# Altium project RF_Power_AMP.PrjPcb
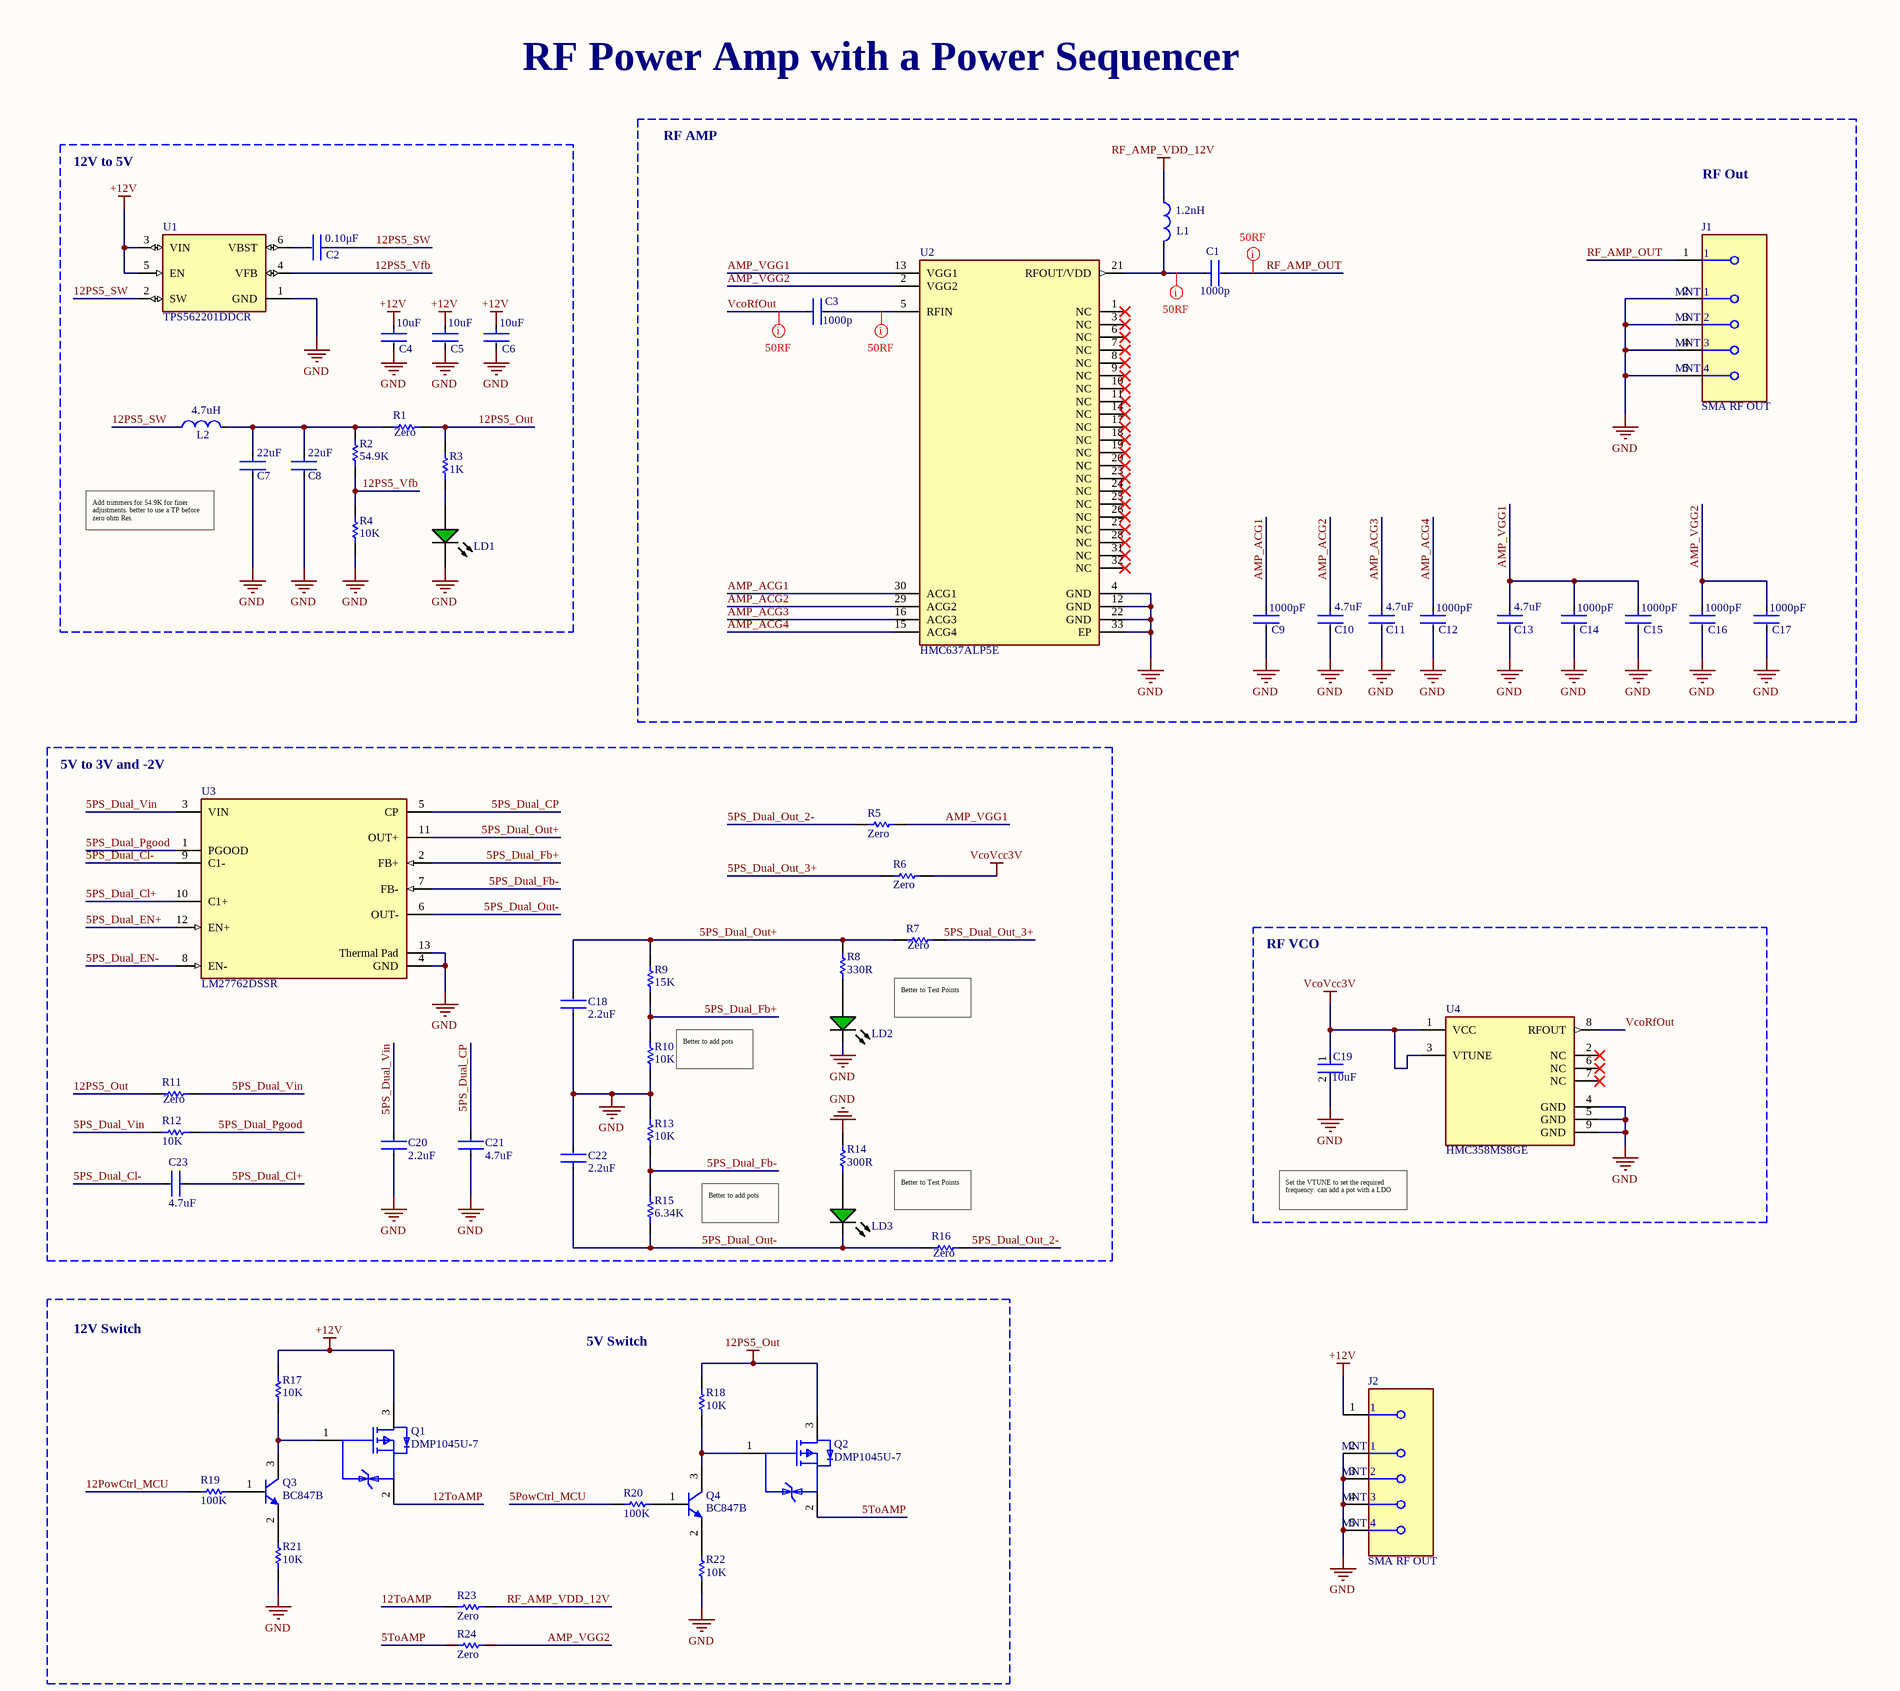
[diagram p0: Sheet1.SchDoc, top]
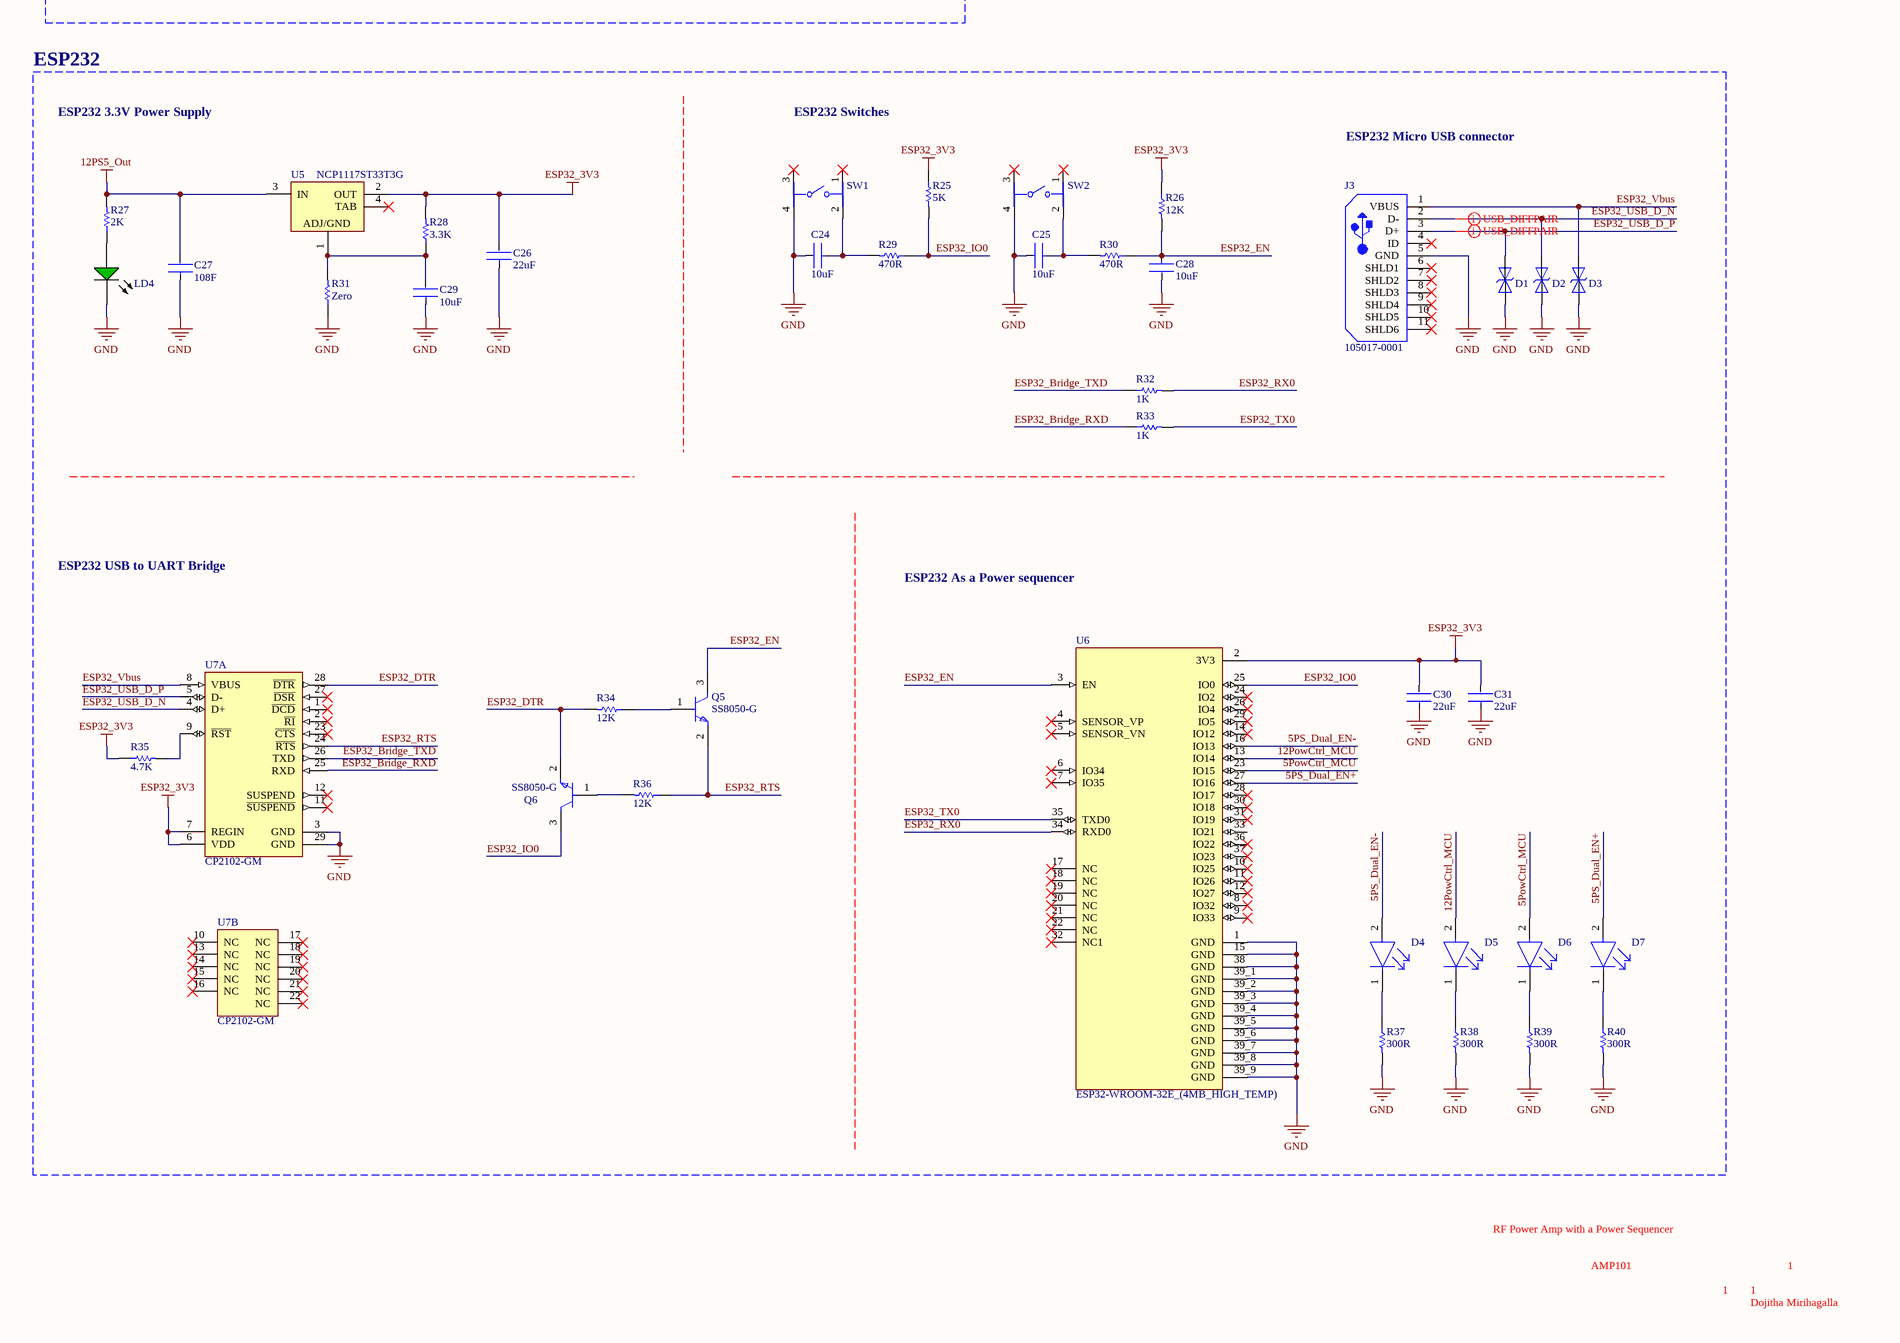
[diagram p1: Sheet1.SchDoc, bottom]
1 sheet, 102 parts. Net scope: global (net labels, ports and power ports of the same name join across sheets).
Board file: PCB1.PcbDoc

## Sheet Sheet1.SchDoc
size 381 x 609 mm; SheetNumber: 1; SheetTotal: 1

### Parts
C1  Capacitance: 1000p  [FP-GCM155-0_05-IPC_A]  (hidden comment: GCM1555C1H102FA16D)
C2  Capacitance: 0.10μF  [FP-GRM15-MFG]  (hidden comment: GRM155R71C104KA88D)
C3  Capacitance: 1000p  [FP-GCM155-0_05-IPC_A]  (hidden comment: GCM1555C1H102FA16D)
C4  Capacitance: 10uF  [FP-GRM188-0_1-e0_2_0_55-IPC_A]  (hidden comment: GRM188R60J106ME47D)
C5  Capacitance: 10uF  [FP-GRM188-0_1-e0_2_0_55-IPC_A]  (hidden comment: GRM188R60J106ME47D)
C6  Capacitance: 10uF  [FP-GRM188-0_1-e0_2_0_55-IPC_A]  (hidden comment: GRM188R60J106ME47D)
C7  Capacitance: 22uF  [FP-GRM21B-0_15-MFG]  (hidden comment: GRM21BR60J226ME39L)
C8  Capacitance: 22uF  [FP-GRM21B-0_15-MFG]  (hidden comment: GRM21BR60J226ME39L)
C9  Capacitance: 1000pF  [FP-0603-L_1_6_0_15-W_0_81-IPC_A]  (hidden comment: 06035C102KAT2A)
C10  Capacitance: 4.7uF  [FP-CL282-IPC_C]  (hidden comment: CL05A475MP5NRNC)
C11  Capacitance: 4.7uF  [FP-CL282-IPC_C]  (hidden comment: CL05A475MP5NRNC)
C12  Capacitance: 1000pF  [FP-0603-L_1_6_0_15-W_0_81-IPC_A]  (hidden comment: 06035C102KAT2A)
C13  Capacitance: 4.7uF  [FP-CL282-IPC_C]  (hidden comment: CL05A475MP5NRNC)
C14  Capacitance: 1000pF  [FP-0603-L_1_6_0_15-W_0_81-IPC_A]  (hidden comment: 06035C102KAT2A)
C15  Capacitance: 1000pF  [FP-0603-L_1_6_0_15-W_0_81-IPC_A]  (hidden comment: 06035C102KAT2A)
C16  Capacitance: 1000pF  [FP-0603-L_1_6_0_15-W_0_81-IPC_A]  (hidden comment: 06035C102KAT2A)
C17  Capacitance: 1000pF  [FP-0603-L_1_6_0_15-W_0_81-IPC_A]  (hidden comment: 06035C102KAT2A)
C18  Capacitance: 2.2uF  [FP-CL282-IPC_C]  (hidden comment: CL05A475MP5NRNC)
C19  Capacitance: 10uF  [FP-GRJ155-0_2-MFG]  (hidden comment: GRJ155R60J106ME11D)
C20  Capacitance: 2.2uF  [FP-CL282-IPC_C]  (hidden comment: CL05A475MP5NRNC)
C21  Capacitance: 4.7uF  [FP-CL282-IPC_C]  (hidden comment: CL05A475MP5NRNC)
C22  Capacitance: 2.2uF  [FP-CL282-IPC_C]  (hidden comment: CL05A475MP5NRNC)
C23  Capacitance: 4.7uF  [FP-CL282-IPC_C]  (hidden comment: CL05A475MP5NRNC)
C24  Capacitance: 10uF  [FP-CL282-IPC_C]  (hidden comment: CL05A475MP5NRNC)
C25  Capacitance: 10uF  [FP-CL282-IPC_C]  (hidden comment: CL05A475MP5NRNC)
C26  Capacitance: 22uF  [FP-CL282-IPC_C]  (hidden comment: CL05A475MP5NRNC)
C27  Capacitance: 108F  [FP-CL282-IPC_C]  (hidden comment: CL05A475MP5NRNC)
C28  Capacitance: 10uF  [FP-CL282-IPC_C]  (hidden comment: CL05A475MP5NRNC)
C29  Capacitance: 10uF  [FP-CL282-IPC_C]  (hidden comment: CL05A475MP5NRNC)
C30  Capacitance: 22uF  [FP-CL282-IPC_C]  (hidden comment: CL05A475MP5NRNC)
C31  Capacitance: 22uF  [FP-CL282-IPC_C]  (hidden comment: CL05A475MP5NRNC)
D1  SMF16A  [SODFL3718X102N]  (value not drawn)
D2  SMF16A  [SODFL3718X102N]  (value not drawn)
D3  SMF16A  [SODFL3718X102N]  (value not drawn)
D4  LTST-C191TBKT  [FP-LTST-C191TBKT-MFG]  (value not drawn)
D5  LTST-C191TBKT  [FP-LTST-C191TBKT-MFG]  (value not drawn)
D6  LTST-C191TBKT  [FP-LTST-C191TBKT-MFG]  (value not drawn)
D7  LTST-C191TBKT  [FP-LTST-C191TBKT-MFG]  (value not drawn)
J1  SMA RF OUT  [FP-SMA-J-P-H-ST-EM1-MFG]
J2  SMA RF OUT  [FP-SMA-J-P-H-ST-EM1-MFG]
J3  105017-0001  [USB-MICRO-B_V]
L1  Inductance: 1.2nH  [FP-LQP03HQ_02-MFG]  (hidden comment: LQP03HQ1N2B02D)
L2  Inductance: 4.7uH  [FP-NR6028-MFG]  (hidden comment: NR6028T4R7M)
LD1  HSMG-C170  [AVAG-HSMX-C170_V]  (value not drawn)
LD2  HSMG-C170  [AVAG-HSMX-C170_V]  (value not drawn)
LD3  HSMG-C170  [AVAG-HSMX-C170_V]  (value not drawn)
LD4  HSMG-C170  [AVAG-HSMX-C170_V]  (value not drawn)
Q1  DMP1045U-7  [FP-SOT23-MFG]
Q2  DMP1045U-7  [FP-SOT23-MFG]
Q3  BC847B  [INF-SOT23_M]
Q4  BC847B  [INF-SOT23_M]
Q5  SS8050-G  [FP-SS8050-G-MFG]
Q6  SS8050-G  [FP-SS8050-G-MFG]
R1  Resistance: Zero  [RESC1609X50X30LL10T20]  (hidden comment: CRCW060354K9FKEA)
R2  Resistance: 54.9K  [RESC1609X50X30LL10T20]  (hidden comment: CRCW060354K9FKEA)
R3  Resistance: 1K  [RESC1609X50X30LL10T20]  (hidden comment: CRCW060354K9FKEA)
R4  Resistance: 10K  [RESC1609X50X30LL10T20]  (hidden comment: CRCW060354K9FKEA)
R5  Resistance: Zero  [RESC1609X50X30LL10T20]  (hidden comment: CRCW060354K9FKEA)
R6  Resistance: Zero  [RESC1609X50X30LL10T20]  (hidden comment: CRCW060354K9FKEA)
R7  Resistance: Zero  [RESC1609X50X30LL10T20]  (hidden comment: CRCW060354K9FKEA)
R8  Resistance: 330R  [RESC1609X50X30LL10T20]  (hidden comment: CRCW060354K9FKEA)
R9  Resistance: 15K  [RESC1609X50X30LL10T20]  (hidden comment: CRCW060354K9FKEA)
R10  Resistance: 10K  [RESC1609X50X30LL10T20]  (hidden comment: CRCW060354K9FKEA)
R11  Resistance: Zero  [RESC1609X50X30LL10T20]  (hidden comment: CRCW060354K9FKEA)
R12  Resistance: 10K  [RESC1609X50X30LL10T20]  (hidden comment: CRCW060354K9FKEA)
R13  Resistance: 10K  [RESC1609X50X30LL10T20]  (hidden comment: CRCW060354K9FKEA)
R14  Resistance: 300R  [RESC1609X50X30LL10T20]  (hidden comment: CRCW060354K9FKEA)
R15  Resistance: 6.34K  [RESC1609X50X30LL10T20]  (hidden comment: CRCW060354K9FKEA)
R16  Resistance: Zero  [RESC1609X50X30LL10T20]  (hidden comment: CRCW060354K9FKEA)
R17  Resistance: 10K  [RESC1609X50X30LL10T20]  (hidden comment: CRCW060354K9FKEA)
R18  Resistance: 10K  [RESC1609X50X30LL10T20]  (hidden comment: CRCW060354K9FKEA)
R19  Resistance: 100K  [RESC1609X50X30LL10T20]  (hidden comment: CRCW060354K9FKEA)
R20  Resistance: 100K  [RESC1609X50X30LL10T20]  (hidden comment: CRCW060354K9FKEA)
R21  Resistance: 10K  [RESC1609X50X30LL10T20]  (hidden comment: CRCW060354K9FKEA)
R22  Resistance: 10K  [RESC1609X50X30LL10T20]  (hidden comment: CRCW060354K9FKEA)
R23  Resistance: Zero  [RESC1609X50X30LL10T20]  (hidden comment: CRCW060354K9FKEA)
R24  Resistance: Zero  [RESC1609X50X30LL10T20]  (hidden comment: CRCW060354K9FKEA)
R25  Resistance: 5K  [RESC1609X50X30LL10T20]  (hidden comment: CRCW060354K9FKEA)
R26  Resistance: 12K  [RESC1609X50X30LL10T20]  (hidden comment: CRCW060354K9FKEA)
R27  Resistance: 2K  [RESC1609X50X30LL10T20]  (hidden comment: CRCW060354K9FKEA)
R28  Resistance: 3.3K  [RESC1609X50X30LL10T20]  (hidden comment: CRCW060354K9FKEA)
R29  Resistance: 470R  [RESC1609X50X30LL10T20]  (hidden comment: CRCW060354K9FKEA)
R30  Resistance: 470R  [RESC1609X50X30LL10T20]  (hidden comment: CRCW060354K9FKEA)
R31  Resistance: Zero  [RESC1609X50X30LL10T20]  (hidden comment: CRCW060354K9FKEA)
R32  Resistance: 1K  [RESC1609X50X30LL10T20]  (hidden comment: CRCW060354K9FKEA)
R33  Resistance: 1K  [RESC1609X50X30LL10T20]  (hidden comment: CRCW060354K9FKEA)
R34  Resistance: 12K  [RESC1609X50X30LL10T20]  (hidden comment: CRCW060354K9FKEA)
R35  Resistance: 4.7K  [RESC1609X50X30LL10T20]  (hidden comment: CRCW060354K9FKEA)
R36  Resistance: 12K  [RESC1609X50X30LL10T20]  (hidden comment: CRCW060354K9FKEA)
R37  Resistance: 300R  [RESC1609X50X30LL10T20]  (hidden comment: CRCW060354K9FKEA)
R38  Resistance: 300R  [RESC1609X50X30LL10T20]  (hidden comment: CRCW060354K9FKEA)
R39  Resistance: 300R  [RESC1609X50X30LL10T20]  (hidden comment: CRCW060354K9FKEA)
R40  Resistance: 300R  [RESC1609X50X30LL10T20]  (hidden comment: CRCW060354K9FKEA)
SW1  PTS645SM43SMTR92LFS  [FP-PTS645SM43SMTR92LFS-MFG]  (value not drawn)
SW2  PTS645SM43SMTR92LFS  [FP-PTS645SM43SMTR92LFS-MFG]  (value not drawn)
U1  TPS562201DDCR  [FP-DDC0006A-IPC_C]
U2  HMC637ALP5E  [FP-HCP-32-1-IPC_A]
U3  LM27762DSSR  [FP-DSS0012B-MFG]
U4  HMC358MS8GE  [FP-MS8GE-MFG]
U5  NCP1117ST33T3G  [ONSC-SOT-223-4-318H-01_A_V]
U6  ESP32-WROOM-32E_(4MB_HIGH_TEMP)  [XCVR_ESP32-WROOM-32E_(4MB_HIGH_TEMP)]
U7  CP2102-GM  [SLAB-QFN-28-3125x3125TP_N]  (parts A,B of 2)

### Blocks framed on the sheet
12V to 5V: C2 C4-C8 L2 LD1 R1-R4 U1
5V to 3V and -2V: C18 C20-C23 LD2 LD3 R5-R16 U3
RF VCO: C19 U4
ESP232: C24-C31 D1-D7 J3 LD4 Q5 Q6 R25-R40 SW1 SW2 U5-U7

### Nets
12PS5_Out: C27.2 Q2.3(D) R1.1 R3.1 R11.2 R18.2 R27.2 U5.3(IN)
+12V: C4.1 C5.1 C6.1 J2.1 Q1.3(D) R17.2 U1.3(VIN) U1.5(EN)
ESP32_3V3: C26.2 C30.2 C31.2 R25.1 R26.1 R28.2 R35.1 U5.2(OUT) U6.2(3V3) U7.6(VDD) U7.7(REGIN)
GND: C4.2 C5.2 C6.2 C7.2 C8.2 C9.2 C10.2 C11.2 C12.2 C13.2 C14.2 C15.2 C16.2 C17.2 C18.1 C19.2 C20.1 C21.1 C22.2 C24.2 C25.2 C26.1 C27.1 C28.2 C29.1 C30.1 C31.1 D1.C D2.C D3.C J1.2(MNT_1) J1.3(MNT_2) J1.4(MNT_3) J1.5(MNT_4) J2.2(MNT_1) J2.3(MNT_2) J2.4(MNT_3) J2.5(MNT_4) J3.5(GND) LD1.2(K) LD2.2(K) LD4.2(K) R4.1 R10.1 R13.2 R14.1 R21.1 R22.1 R31.1 R37.2 R38.2 R39.2 R40.2 SW1.4 SW2.4 U1.1(GND) U2.4(GND) U2.12(GND) U2.22(GND) U2.33(EP) U3.4(GND) U3.13(Thermal_Pad) U4.4(GND) U4.5(GND) U4.9(GND) U6.1(GND) U6.15(GND) U6.38(GND) U6.39_1(GND) U6.39_2(GND) U6.39_3(GND) U6.39_4(GND) U6.39_5(GND) U6.39_6(GND) U6.39_7(GND) U6.39_8(GND) U6.39_9(GND) U7.3(GND) U7.29(GND)
RF_AMP_VDD_12V: L1.1 R23.2
VcoVcc3V: C19.1 R6.2 U4.1(VCC) U4.3(VTUNE)
5PowCtrl_MCU: D6.2(A) R20.1 U6.23(IO15)
5PS_Dual_Cl+: C23.1 U3.10(C1+)
5PS_Dual_Cl-: C23.2 U3.9(C1-)
5PS_Dual_CP: C21.2 U3.5(CP)
5PS_Dual_EN+: D7.2(A) U3.12(EN+) U6.27(IO16)
5PS_Dual_EN-: D4.2(A) U3.8(EN-) U6.16(IO13)
5PS_Dual_Fb+: R9.1 R10.2 U3.2(FB+)
5PS_Dual_Fb-: R13.1 R15.2 U3.7(FB-)
5PS_Dual_Out+: C18.2 R7.2 R8.1 R9.2 U3.11(OUT+)
5PS_Dual_Out-: C22.1 LD3.2(K) R15.1 R16.2 U3.6(OUT-)
5PS_Dual_Out_2-: R5.1 R16.1
5PS_Dual_Out_3+: R6.1 R7.1
5PS_Dual_Pgood: R12.2 U3.1(PGOOD)
5PS_Dual_Vin: C20.2 R11.1 R12.1 U3.3(VIN)
5ToAMP: Q2.2(S) R24.1
12PowCtrl_MCU: D5.2(A) R19.1 U6.13(IO14)
12PS5_SW: C2.2 L2.1 U1.2(SW)
12PS5_Vfb: R2.1 R4.2 U1.4(VFB)
12ToAMP: Q1.2(S) R23.1
AMP_ACG1: C9.1 U2.30(ACG1)
AMP_ACG2: C10.1 U2.29(ACG2)
AMP_ACG3: C11.1 U2.16(ACG3)
AMP_ACG4: C12.1 U2.15(ACG4)
AMP_VGG1: C13.1 C14.1 C15.1 R5.2 U2.13(VGG1)
AMP_VGG2: C16.1 C17.1 R24.2 U2.2(VGG2)
ESP32_Bridge_RXD: R33.1 U7.25(RXD)
ESP32_Bridge_TXD: R32.1 U7.26(TXD)
ESP32_DTR: Q6.2(E) R34.2 U7.28(~{DTR})
ESP32_EN: C28.1 Q5.3(C) R26.2 R30.1 U6.3(EN)
ESP32_IO0: Q6.3(C) R25.2 R29.1 U6.25(IO0)
ESP32_RTS: Q5.2(E) R36.1 U7.24(~{RTS})
ESP32_RX0: R32.2 U6.34(RXD0)
ESP32_TX0: R33.2 U6.35(TXD0)
ESP32_USB_D_N: D2.A J3.2(D-) U7.4(D+)
ESP32_USB_D_P: D1.A J3.3(D+) U7.5(D-)
ESP32_Vbus: D3.A J3.1(VBUS) U7.8(VBUS)
RF_AMP_OUT: C1.2 J1.1
VcoRfOut: C3.1 U4.8(RFOUT)
NetC1_1: C1.1 L1.2 U2.21(RFOUT/VDD)
NetC2_1: C2.1 U1.6(VBST)
NetC3_2: C3.2 U2.5(RFIN)
NetC7_1: C7.1 C8.1 L2.2 R1.2 R2.2
NetC24_1: C24.1 R29.2 SW1.2
NetC25_1: C25.1 R30.2 SW2.2
NetC29_2: C29.2 R28.1 R31.2 U5.1(ADJ/GND)
NetD4_1: D4.1(C) R37.1
NetD5_1: D5.1(C) R38.1
NetD6_1: D6.1(C) R39.1
NetD7_1: D7.1(C) R40.1
NetLD1_1: LD1.1(A) R3.2
NetLD2_1: LD2.1(A) R8.2
NetLD3_1: LD3.1(A) R14.2
NetLD4_1: LD4.1(A) R27.1
NetQ1_1: Q1.1(G) Q3.3(C) R17.1
NetQ2_1: Q2.1(G) Q4.3(C) R18.1
NetQ3_1: Q3.1(B) R19.2
NetQ3_2: Q3.2(E) R21.2
NetQ4_1: Q4.1(B) R20.2
NetQ4_2: Q4.2(E) R22.2
NetQ5_1: Q5.1(B) R34.1
NetQ6_1: Q6.1(B) R36.2
NetR35_2: R35.2 U7.9(~{RST})

Not connected (* = marked no-connect by the designer): J3 4(ID)* 6(SHLD1)* 7(SHLD2)* 8(SHLD3)* 9(SHLD4)* 10(SHLD5)* 11(SHLD6)*; SW1 1* 3*; SW2 1* 3*; U2 1(NC)* 3(NC)* 6(NC)* 7(NC)* 8(NC)* 9(NC)* 10(NC)* 11(NC)* 14(NC)* 17(NC)* 18(NC)* 19(NC)* 20(NC)* 23(NC)* 24(NC)* 25(NC)* 26(NC)* 27(NC)* 28(NC)* 31(NC)* 32(NC)*; U4 2(NC)* 6(NC)* 7(NC)*; U5 4(TAB)*; U6 4(SENSOR_VP)* 5(SENSOR_VN)* 6(IO34)* 7(IO35)* 8(IO32)* 9(IO33)* 10(IO25)* 11(IO26)* 12(IO27)* 14(IO12)* 17(NC)* 18(NC)* 19(NC)* 20(NC)* 21(NC)* 22(NC)* 24(IO2)* 26(IO4)* 28(IO17)* 29(IO5)* 30(IO18)* 31(IO19)* 32(NC1)* 33(IO21) 36(IO22)* 37(IO23)*; U7 1(~{DCD})* 2(~{RI})* 10(NC)* 11(~{SUSPEND})* 12(SUSPEND)* 13(NC)* 14(NC)* 15(NC)* 16(NC)* 17(NC)* 18(NC)* 19(NC)* 20(NC)* 21(NC)* 22(NC)* 23(~{CTS})* 27(~{DSR})*

### Layout directives
differential pair: ESP32_USB_D_N, ESP32_USB_D_P
net class 50RF: NetC1_1, NetC3_2, RF_AMP_OUT, VcoRfOut

### Notes on the sheet
- RF Power Amp with a Power Sequencer
- RF AMP
- RF Out
- Add trimmers for 54.9K for finer adjustments. better to use a TP before zero ohm Res.
- Better to Test Points
- (near R10) Better to add pots
- Better to add pots
- Set the VTUNE to set the required frequency. can add a pot with a LDO
- 12V Switch
- 5V Switch
- ESP232 3.3V Power Supply
- ESP232 Switches
- ESP232 Micro USB connector
- ESP232 USB to UART Bridge
- ESP232 As a Power sequencer
- AMP101
- 1
- Dojitha Mirihagalla

### Library data of the parts
C1 C3 = CMP-06035-056113-1: Ceramic Capacitor for Automotive 1nF ±1% 50VDC C0G 0402 Paper T/R; Voltage Rating: 50V; Case Code (Metric): 1005; Packaging: Tape and Reel; Max Operating Temperature: 125°C; Min Operating Temperature: -55°C; Case Code (Imperial): 0402; Mount: Surface Mount; Ratings: AEC-Q200; Tolerance: 1%; Case/Package: 0402
C2 = CMP-2100-03641-2: CAP CER 0.1UF 16V X7R 0402; Manufacturer: Murata; Standoff Height: 0mm; Tolerance: 10%; Voltage Rating: 16Vdc; Material: Ceramic; Value: 0.10μF; RoHS: TRUE; Manufacturer Part Number: GRM155R71C104KA88D; Temperature Characteristic: X7R; Octopart: https://octopart.com/grm155r71c104ka88d-murata-196880; Digikey Description: CAP CER 0.1UF 16V X7R 0402; Device Class L3: Ceramic Capacitors; Height: 0.55mm; ComponentLink2Description: Datasheet; Temperature Range Low: -55°C; Ipc Land Pattern Name: CAPC10050X219; ComponentLink2URL: https://search.murata.co.jp/Ceramy/image/img/A01X/G101/ENG/GRM155R71H471KA01-01A.pdf; Device Class L1: Passive Components; Lead Free: yes; Category: Cap; Package: GRM15; Temperature: -55°C to +125°C; Device Class L2: Capacitors; Temperature Range High: +125°C; Mouser Description: 0402 0.1 uF 16V ±10 % Tolerance X7R SMT Multilayer Ceramic Capacitor
C4-C6 = CMP-2006-02792-2: Chip Multilayer Ceramic Capacitors for General Purpose, 0603, 10uF, X5R, 15%, 20%, 6.3V; Packaging: Tape and Reel; Voltage Rating (DC): 6.3V; Width: 0.031inch; Termination: SMD/SMT; Dielectric: X5R; Package Quantity: 4000; Voltage Rating: 6.3V; Case/Package: 0603; Min Operating Temperature: -55°C; Voltage: 6.3V; Length: 1.6mm; Thickness: 0.035inch; Lead Free: Lead Free; Depth: 0.8mm; Case Code (Imperial): 0603; Max Operating Temperature: 85°C; Material: Ceramic; Height: 0.8mm; Tolerance: 20%; Mount: Surface Mount; REACH SVHC: No SVHC; Radiation Hardening: No; Case Code (Metric): 1608
C7 C8 = CMP-2007-03385-2: Chip Multilayer Ceramic Capacitors for General Purpose, 0805, 22uF, X5R, 15%, 20%, 6.3V; Material: Ceramic; Max Operating Temperature: 85°C; Voltage: 6.3V; Min Operating Temperature: -55°C; Case/Package: 0805; Thickness: 0.053inch; Dielectric: X5R; Packaging: Tape and Reel; Depth: 1.25mm; Termination: SMD/SMT; Voltage Rating (DC): 6.3V; Radiation Hardening: No; Tolerance: 20%; Mount: Surface Mount; Lead Free: Lead Free; Package Quantity: 1; REACH SVHC: No SVHC; Voltage Rating: 6.3V; Length: 2mm; Case Code (Imperial): 0805; Case Code (Metric): 2012; Width: 0.049inch; Height: 1.25mm
C9 C12 C14-C17 = CMP-2006-04378-2: General Purpose Ceramic Capacitor, 0603, 1nF, 10%, X7R, 15%, 50V; Case Code (Metric): 1608; Min Operating Temperature: -55°C; Weight: 7.1E-05oz; Series: -; RoHS Compliant: Yes; Radiation Hardening: No; Height: 0.9mm; Mount: Surface Mount; REACH SVHC: No SVHC; Lead Free: Lead Free; Depth: 0.81mm; Voltage: 50V; Number of Pins: 2; Voltage Rating: 50V; Max Operating Temperature: 125°C; Termination: SMD/SMT; Construction: Flat; Case Code (Imperial): 0603; Dielectric: X7R; Width: 0.032inch; Tolerance: 10%; Case/Package: 0603; Contact Plating: Tin; Packaging: Tape and Reel; Voltage Rating (DC): 50V; Dielectric Material: Ceramic; Package Quantity: 4000; Thickness: 0.035inch; Length: 1.6mm
C10 C11 C13 C18 C20-C31 = CMP-13271-000548-1: Cap Ceramic 4.7uF 10V X5R ±20% SMD 0402 +85°C Paper T/R; Max Operating Temperature: 85°C; Lead Free: Lead Free; Tolerance: 20%; Voltage Rating: 10V; Dielectric: X5R; Width: 0.02inch; Length: 0.039inch; Case/Package: 0402; Min Operating Temperature: -55°C; Packaging: Tape and Reel; Thickness: 0.022inch; Case Code (Imperial): 0402; Package Quantity: 10000; Case Code (Metric): 1005; Mount: Surface Mount
C19 = CMP-06035-062410-1: CAP CER 10UF 6.3V X5R 0402; Tolerance: 20%; Length: 0.039inch; Width: 0.02inch; Max Operating Temperature: 85°C; Features: Soft Termination; Case Code (Metric): 1005; Min Operating Temperature: -55°C; Thickness: 0.028inch; Mount: Surface Mount; Packaging: Cut Tape; Case/Package: 0402; Voltage Rating: 6.3V; Case Code (Imperial): 0402; RoHS Compliant: Yes
D1-D3 = SMF16A: 200W, 18.8V, 5%, Unidirectional, TVS; MF: Taiwan Semiconductor; SnapEDA_Link: https://www.snapeda.com/parts/SMF16A/taiwan/view-part/?ref=snap; Package: SOD-123W-2 Taiwan Semiconductor; Value: *; MP: SMF16A; Check_prices: https://www.snapeda.com/parts/SMF16A/taiwan/view-part/?ref=eda
D4-D7 = CMP-22017-000008-1: LED BLUE CLEAR CHIP SMD; Lens Color: Colorless; Dominant Wavelength: 475nm; Forward Current: 20mA; Wavelength: 468nm; Viewing Angle: 130°; Power Dissipation: 76mW; Luminous Intensity: 180mcd; Reverse Voltage: 5V; Number of Elements: 1; Lens Style: Diffused; Forward Voltage: 3.8V; Max Power Dissipation: 75mW; Case Code (Metric): 1608; Packaging: Tape and Reel; Case/Package: 0603; Depth: 1.6mm; Mount: Surface Mount; Lead Free: Lead Free; Min Operating Temperature: -20°C; Lens Transparency: Clear; Illumination Color: Blue; Height: 0.55mm; Test Current: 20mA; Case Code (Imperial): 0603; Max Operating Temperature: 80°C; Number of Pins: 2; Length: 0.8mm; Radiation Hardening: No; Package Quantity: 1; Number of LEDs: 1; Width: 0.8mm; Color: Blue
J1 J2 = CMP-02754-000006-1: CONN SMA JACK STR 50OHM EDGE MNT; Dielectric Material: PTFE; Center Contact Plating: Gold; Max Frequency: 6GHz; Body Material: Brass; Voltage Rating: 335V; Impedance: 50R; Package Quantity: 1; Case/Package: SMA; Max Operating Temperature: 125°C; Fastening Type: Threaded; Orientation: Straight; Depth: 13.33mm; RoHS Compliant: Yes; Length: 6.35mm; Insulation Material: Polytetrafluoroethylene; Termination: Solder; Min Operating Temperature: -65°C; Housing Color: Gold; Contact Plating: Gold; Contact Material: Copper; Connector Type: SMA; Mount: Edge; Series: SMA; Packaging: Tray; Body Plating: Gold; Radiation Hardening: No
J3 = CMP-2000-05827-1: Micro-USB B Receptacle, Right Angle, Bottom Mount, Surface Mount, with Solder Tabs, -30 to 85 degC, 5-Pin USB, RoHS, Tape and Reel; Manufacturer: Molex; Featured Product: Micro-USBConnectorsUSBConnectors; Other Names: WM1399DKR; Package Version: Rev. F, 12/2012; Number of Contacts: 5; Connector Type: USB-microB; Catalog Drawings: 1050170001; 3D Model: 105017-0001.stp; Mating Products: WM17145-ND-CABLEMICROUSBBTOSTDA1.0MWM17147-ND-CABLEMICROUSBBTOSTDA2.0MWM17146-ND-CABLEMICROUSBBTOSTDA1.5M; PCN Assembly/Origin: ResinSupplier21/Oct/2015; Voltage - Max: 30V; Online Catalog: Molex-MicroUSB; Manufacturer URL: http://www.molex.com/; Package Description: 5-Leads USB, Micro B, Body 7.5 x 5 mm, Pitch 0.65 mm; Datasheet URL: http://www.molex.com/elqNow/elqRedir.htm?ref=http://www.molex.com/webdocs/datasheets/pdf/en-us/1050170001_IO_CONNECTORS.pdf; Ingress Protection: -; Datasheet Version: 03/2016; Mounting Type: BoardCutout,SurfaceMount,RightAngle; Circuits: 5; Standard Package: 1; Package Reference: MICRO-B; Package URL: http://www.molex.com/pdm_docs/sd/1050170001_sd.pdf; Category: Connectors,Interconnects; Series: -; RoHS Information: 1050170001CertofCompliance; Features: Shielded,SolderRetention; Family: USB,DVI,HDMIConnectors; Specifications: -; Gender: Receptacle; Packaging: Digi-Reel®; Mounting Technology: SurfaceMount
L1 = CMP-06042-014208-1: Film type RF Inductor 1.2nH ±0.1nH 1100mA 0.04Ω 0201 (0603); Test Frequency: 500MHz; Self Resonant Frequency: 13GHz; Core Material: Non-Magnetic; DC Resistance (DCR): 40mR; Current Rating: 1.1A; Shielding: Unshielded; Mount: Surface Mount; Case/Package: 0201; Resistor Type: Thin Film; Min Operating Temperature: -55°C; Packaging: Tape and Reel; Case Code (Imperial): 0201; Case Code (Metric): 0603; Max Operating Temperature: 125°C
L2 = CMP-14484-000037-2: SMD Power Inductors 4.7uH ±20% 2.7A 40.3mΩ; Max DC Current: 3A; Shielding: Shielded; Core Material: Ferrite; Test Frequency: 100kHz; Self Resonant Frequency: 39MHz; DC Resistance (DCR): 40.3mR; Package Quantity: 2000; Mount: Surface Mount; Max Operating Temperature: 120°C; Min Operating Temperature: -25°C; Series: NR; Case/Package: 2424; Depth: 6.2mm; Inductance Tolerance: 20%; Halogen Free: Halogen Free; Tolerance: 20%; RoHS Compliant: Yes; Width: 0.236inch; Length: 0.236inch; Lead Free: Lead Free; Radiation Hardening: No; Packaging: Tape and Reel; Number of Pins: 2; Saturation Current: 2.7A; Current Rating: 3A; Height - Seated (Max): 0.11inch; RMS Current (Irms): 3A; Termination: SMD/SMT; Height: 2.8mm; Resistor Type: Wirewound
LD1-LD4 = CMP-2000-05062-1: Chip LED, Green, 2.2 V, -40 to 85 degC, 2-Pin SMD, Pb-Free, Tape and Reel; Manufacturer: Avago; No. of Pins: 2; Peak Wavelength: 570nm; SVHC: NoSVHC(16-Jun-2014); Dominant Wavelength: 572nm; Forward Current If: 20mA; Viewing Angle: 170deg; Lens Shape: Rectangular; PIV Max: 5V; External Width: 1.25mm; LED Type: Standard; External Depth: 0.8mm; Opto Mounting Orientation: Top; Luminous Intensity: 15mcd; Luminous Intensity Min: 4mcd; Forward Voltage VF Max: 2.6V; External Length / Height: 2mm; Bulb Size: 1.25mmx1.4mm; Light Area Height: 1mm; Voltage Vf Typ: 2.2V; Operating Temperature Max: 85degC; Datasheet Version: Oct-08; MSL: MSL2A-4weeks; Peak Forward Current: 20mA; Package Description: 2-Pin Surface Mount Device, Body 2 x 1.25 mm, Height 0.8 mm; Datasheet URL: https://datasheet.ciiva.com/29280/180495-da-01-en-chip-led-hsmg-c170-gelb-gruen-29280971.pdf; Storage Temperature Min: -40degC; LED Colour: Green; Wavelength Typ: 570nm; Mounting Type: SMD; Forward Current If Max: 20mA; Dominant Wavelength Typ: 572nm; LED Mounting: SMD; Operating Temperature Range: -30degCto+85degC; Operating Temperature Min: -30degC; Manufacturer URL: http://www.avagotech.com/; Packaging: CutTape; Luminous Intensity Typ: 15mcd; Package Reference: HSMX-C170; Storage Temperature Max: 85degC; Opto Case Style: SMD; Forward Voltage: 2.2V
Q1 Q2 = CMP-12801-000025-1: MOSFET P-CH 12V 4A SOT23; Manufacturer: Diodes Inc.; Drain To Source Voltage: -12V; Standoff Height: 0.013mm; Max Junction Temp: +150°C; Gate To Source Voltage: 8V; Number Of Channels: 1; Drain To Source Resistance: 26mΩ; Gate Charge At Vgs: 15.8nC @ -4.5V; Power Dissipation: 0.8W; Automotive Grade: NA; Pulse Drain Current: 40A; Turn Off Delay Time: 91.2ns; Depletion Mode: False; Threshold Vgs Min: -0.3V; Input Capacitace At Vds: 1357pF @ -10V; Threshold Vgs Max: -1V; Typ Forward Diode Voltage: -0.6V; Turn On Delay Time: 15.7ns; Rthja Max: 168°C/W; Category: Trans; RoHS: TRUE; Manufacturer Part Number: DMP1045U-7; Automotive: No; Continuous Drain Current: 4A; Package: SOT23; ComponentLink2Description: Datasheet; Lead Free: Yes; Device Class L3: MOSFETs; Device Class L2: Transistors; Digikey Description: MOSFET P-CH 12V 4A SOT23; Drain To Source Breakdown Voltage: -12V; Device Class L1: Discrete Semiconductors; Height: 1.1mm; Temperature Range Low: -55°C; Mouser Description: P-Channel 12 V 31 mOhm Surface Mount Enhancement Mode Mosfet - SOT-23-3; Temperature: -55°C to +150°C; Octopart: https://octopart.com/dmp1045u-7-diodes+inc.-20474459; Ipc Land Pattern Name: SOT92P240X102-3; ComponentLink2URL: https://www.diodes.com/assets/Datasheets/DMP1045U.pdf; Number Of P Channels: 1; Footprint Url: https://www.diodes.com/assets/Package-Files/SOT23.pdf; Temperature Range High: +150°C
Q3 Q4 = CMP-1177-00042-1: NPN Silicon AF Transistor, 45 V VCEO, 100 mA IC, SOT23, Reel, Green; Manufacturer: Infineon; VEBO (max): 6Â V; ICBO (max): 15Â nA; VCBO (max): 50Â V; IBM (max): 200Â mA; Green: TRUE; Ptot (max): 330Â mW; fT (typ): 250Â MHz; IC (max): 100Â mA; VCEO (max): 45Â V; PackageDescription: 3-Pin Small Outline Transistor Package, 1.3 x 2.9 mm Body, 0.95 mm Pitch; ComponentLink3URL: http://www.infineon.com/dgdl/SOT23-Package_Overview.pdf?folderId=db3a30431936bc4b0119532290053c66&fileId=db3a30431936bc4b0119533468123c85; PackageVersion: Apr-08; Packing: Reel; ComponentLink3Description: Package Specification; ComponentLink2URL: http://www.infineon.com/dgdl/bc847series_bc848series_bc849series_bc850series.pdf?folderId=db3a304314dca389011541d30fa21656&fileId=db3a304314dca389011541d4630a1657; ComponentLink1URL: http://www.infineon.com/; ComponentLink2Description: Datasheet; Polarity: NPN; Mounting Technology: Surface Mount; PackageReference: SOT23; ICM (max): 200Â mA; ComponentLink1Description: Manufacturer URL; PartNumber: BC847B
Q5 Q6 = CMP-20235-000001-1: NPN TRANSISTOR 1.5A 40V SOT-23 R; Transition Frequency: 100MHz; Max Breakdown Voltage: 25V; Collector Emitter Voltage (VCEO): 400mV; Max Power Dissipation: 300mW; Max Collector Current: 1.5A; Case/Package: TO-236-3; Packaging: Tape and Reel; RoHS Compliant: Yes; Mount: Surface Mount; Collector Emitter Breakdown Voltage: 25V
R1-R40 = CMP-2000-03459-1: Manufacturer: Vishay Dale; Part Number: CRCW060354K9FKEA
SW1 SW2 = CMP-2000-05160-2: SWITCH TACTILE SPST-NO 0.05A 12V; Contact Resistance: 100mR; Throw Configuration: SPST; Illumination Type: Non-Illuminated; Mechanical Life: 100000Cycles; Current Rating: 50mA; Switch Function: Off-Mom; Actuator Length: 0.85mm; Actuator Material: Nylon; Actuator Type: Standard; Operating Force: 160gf; Min Operating Temperature: -20°C; REACH SVHC: No SVHC; Termination: Gull Wing; Case/Package: SMD/SMT; Packaging: Tape and Reel; Mount: Surface Mount; Voltage Rating (DC): 12V; Orientation: Straight; Lead Free: Lead Free; Contact Material: Silver; Color: Black; Max Current Rating: 50mA; Contact Plating: Silver; Depth: 9mm; Package Quantity: 1; Max Voltage Rating (DC): 12V; Length: 6mm; Max Operating Temperature: 60°C
U1 = CMP-04918-000361-1: IC REG BUCK ADJ 2A TSOT23-6; Switching Frequency: 580kHz; Max Input Voltage: 17V; Number of Outputs: 1; Output Voltage: 7V; Output Type: Adjustable; Quiescent Current: 400uA; Min Input Voltage: 4.5V; Mount: Surface Mount; Max Operating Temperature: 125°C; Lead Free: Lead Free; Operating Supply Voltage: 17V; Number of Pins: 6; RoHS Compliant: Yes; Contact Plating: Tin; Min Operating Temperature: -40°C; Case/Package: SOT; Max Output Current: 2A
U2 = CMP-09142-000117-1: IC MMIC MESFET GAAS 1W 32-QFN; Max Supply Voltage: 14V; Gain: 13dB; Number of Channels: 1; Noise Figure: 5dB; P1dB: 29dBm; Max Power Dissipation: 8.6W; Operating Supply Voltage: 12V; Operating Supply Current: 400mA; Case/Package: QFN; Mount: Surface Mount; Packaging: Tray; Weight: 0.006653oz; Contact Plating: Tin; Min Operating Temperature: -40°C; RoHS Compliant: No; Max Operating Temperature: 85°C; Package Quantity: 50; Lead Free: Contains Lead; Number of Pins: 32
U3 = CMP-04918-000139-2: IC REG CHARGE PUMP ADJ DL 12WSON; Min Output Voltage: 1.5V; Max Input Voltage: 5.5V; Synchronous Rectifier: No; Output Type: Adjustable; Output Current: 250mA; Min Input Voltage: 2.7V; Quiescent Current: 390uA; Switching Frequency: 2.3MHz; Max Output Voltage: 5V; Topology: Charge Pump; Lead Free: Lead Free; Min Operating Temperature: -40°C; Max Operating Temperature: 85°C; RoHS Compliant: Yes; Packaging: Tape and Reel; Mount: Surface Mount
U4 = CMP-09141-000299-1: IC MMIC AMP VCO BUFFER 8-MSOP; Frequency: 6.8GHz; Max Supply Voltage: 3.25V; Operating Supply Voltage: 3V; Min Supply Voltage: 2.75V; Series: -; Packaging: Cut Strip; Package Quantity: 50; Max Operating Temperature: 85°C; Termination: SMD/SMT; Number of Pins: 8; Lead Free: Contains Lead; Case/Package: MSOP; Min Operating Temperature: -40°C; Logic Function: Buffer; RoHS Compliant: Yes; Reach SVHC Compliant: Yes
U5 = CMP-1679-00010-1: Low-Dropout Positive Fixed Voltage Regulator, 1 A, 3.3 V Output Voltage, 0 to 125 degC, 4-Pin SOT-223 (318H-01), Pb-Free, Tape and Reel; Resistance: 220 kohm; Type (Resistor): Thick Film; Voltage Rating: 75 V; Tolerance: 1%; Case\Package: 0603; Power Rating: 100 mW; Width: 0.85 mm; Weight: 7.1E-05 oz; ComponentLink2URL: http://www.onsemi.com/pub_link/Collateral/NCP1117-D.PDF; RoHSCompliant: true; Height: 0.45 mm; PackageDescription: 4-Pin Small Outline Transistor, Body 6.5 x 3.5 mm, Pitch 2.3 mm; ComponentLink1Description: Manufacturer URL; ComponentLink1URL: http://www.onsemi.com/; PackageReference: SOT-223-4-318H-01_A; Max Operating Temperature: 155 degC; Packaging: Tape and Reel; REACH SVHC: Unknown; Length: 1.55 mm; Package Quantity: 5000; Radiation Hardening: No; Min Operating Temperature: -55 degC; DatasheetVersion: Rev. 27, 09/2014; Mount: Surface Mount; Case Code (Imperial): 0603; Case Code (Metric): 1608; ComponentLink2Description: Datasheet
U6 = ESP32-WROOM-32E_(4MB_HIGH_TEMP): Bluetooth, WiFi 802.11b/g/n, Bluetooth v4.2 +EDR, Class 1, 2 and 3 Transceiver Module 2.4GHz ~ 2.5GHz Integrated, Trace Surface Mount; MF: Espressif Systems; MP: ESP32-WROOM-32E (4MB HIGH TEMP); Package: SMD-44 Espressif Systems; Check_prices: https://www.snapeda.com/parts/ESP32-WROOM-32E%20(4MB%20HIGH%20TEMP)/Espressif+Systems/view-part/?ref=eda; Value: *; Price: None; Purchase-URL: https://pricing.snapeda.com/search/part/ESP32-WROOM-32E (4MB HIGH TEMP)/?ref=eda; SnapEDA_Link: https://www.snapeda.com/parts/ESP32-WROOM-32E%20(4MB%20HIGH%20TEMP)/Espressif+Systems/view-part/?ref=snap; Availability: In Stock
U7 = CMP-0511-00012-1: Single-Chip USB to UART Bridge, 1024 Bytes EEPROM, -40 to 85 degC, 28-pin QFN, Tube; Manufacturer: Silicon Labs; Internal Oscillator: TRUE; Sub-Family: USB Bridges; ComponentLink3Description: Package Specification; PackageDescription: 28-Pin Quad-Flat No-Leads Package, Body 5 x 5 mm, Pitch 0.5 mm; PartNumber: CP2102-GM; EEPROM: 1024 Bytes; Mounting Technology: Surface Mount; ComponentLink2URL: http://www.silabs.com/Support%20Documents/TechnicalDocs/CP2102-9.pdf; DatasheetVersion: Rev. 1.5; ComponentLink1URL: http://www.silabs.com/; ComponentLink2Description: Datasheet; Code_JEDEC: MO-220; PackageReference: QFN-28; Code_IPC: J-STD-020C; ComponentLink3URL: http://www.silabs.com/Support%20Documents/TechnicalDocs/C8051T61x.pdf; ComponentLink1Description: Manufacturer URL